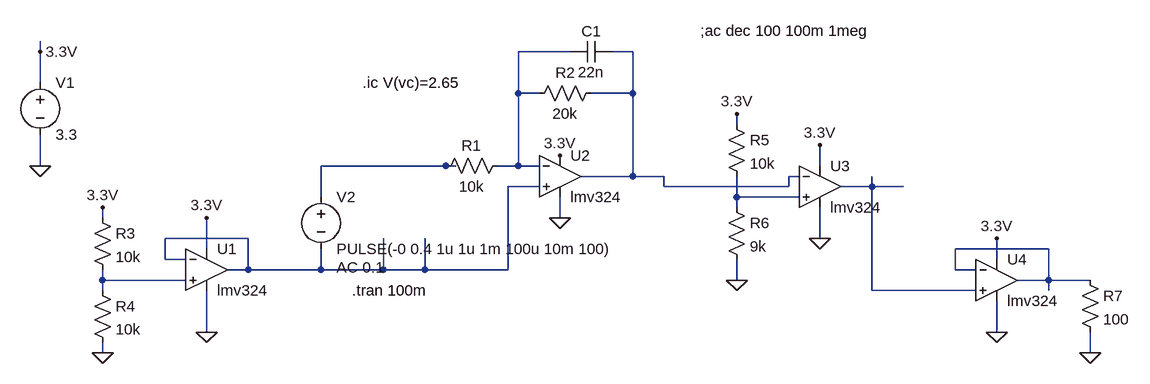
[diagram p0: schematic Piezo_amplifier.asc]
Piezo_amplifier.asc, the LTspice schematic file:
Version 4
SHEET 1 1092 680
WIRE -592 -16 -592 -32
WIRE 224 -16 144 -16
WIRE 320 -16 288 -16
WIRE -592 32 -592 -16
WIRE 144 48 144 -16
WIRE 176 48 144 48
WIRE 320 48 320 -16
WIRE 320 48 256 48
WIRE 480 96 480 80
WIRE -592 160 -592 112
WIRE 32 160 -160 160
WIRE 48 160 32 160
WIRE 144 160 144 48
WIRE 144 160 112 160
WIRE 176 160 144 160
WIRE 608 160 608 128
WIRE 320 176 320 48
WIRE 320 176 240 176
WIRE 368 176 320 176
WIRE 576 176 560 176
WIRE 176 192 128 192
WIRE 368 192 368 176
WIRE 560 192 560 176
WIRE 560 192 368 192
WIRE 688 192 688 176
WIRE 688 192 640 192
WIRE 736 192 688 192
WIRE -160 208 -160 160
WIRE 480 208 480 176
WIRE 576 208 480 208
WIRE 480 224 480 208
WIRE -496 240 -496 224
WIRE 208 240 208 208
WIRE -272 272 -400 272
WIRE 608 272 608 224
WIRE -336 288 -336 240
WIRE 960 288 816 288
WIRE -400 304 -400 272
WIRE -368 304 -400 304
WIRE 880 304 880 272
WIRE -272 320 -272 272
WIRE -272 320 -304 320
WIRE -160 320 -160 288
WIRE -160 320 -272 320
WIRE -64 320 -64 272
WIRE -64 320 -160 320
WIRE 0 320 0 272
WIRE 0 320 -64 320
WIRE 128 320 128 192
WIRE 128 320 0 320
WIRE 816 320 816 288
WIRE 848 320 816 320
WIRE -496 336 -496 320
WIRE -368 336 -496 336
WIRE 480 336 480 304
WIRE 960 336 960 288
WIRE 960 336 912 336
WIRE 1024 336 960 336
WIRE -496 352 -496 336
WIRE 688 352 688 192
WIRE 848 352 688 352
WIRE 960 352 960 336
WIRE -336 416 -336 352
WIRE 880 416 880 368
WIRE -496 448 -496 432
WIRE 1024 448 1024 416
FLAG -592 160 0
FLAG -592 -16 3.3V
FLAG 208 144 3.3V
FLAG 208 240 0
FLAG -336 240 3.3V
FLAG -336 416 0
FLAG -496 448 0
FLAG -496 224 3.3V
FLAG 608 128 3.3V
FLAG 608 272 0
FLAG 480 336 0
FLAG 480 80 3.3V
FLAG 880 272 3.3V
FLAG 880 416 0
FLAG 1024 448 0
SYMBOL voltage -592 16 R0
WINDOW 123 0 0 Left 0
WINDOW 39 0 0 Left 0
SYMATTR InstName V1
SYMATTR Value 3.3
SYMBOL res -512 224 R0
SYMATTR InstName R3
SYMATTR Value 10k
SYMBOL res -512 336 R0
SYMATTR InstName R4
SYMATTR Value 10k
SYMBOL res 464 80 R0
SYMATTR InstName R5
SYMATTR Value 10k
SYMBOL res 464 208 R0
SYMATTR InstName R6
SYMATTR Value 9k
SYMBOL res 128 144 R90
WINDOW 0 0 56 VBottom 2
WINDOW 3 32 56 VTop 2
SYMATTR InstName R1
SYMATTR Value 10k
SYMBOL res 272 32 R90
WINDOW 0 0 56 VBottom 2
WINDOW 3 32 56 VTop 2
SYMATTR InstName R2
SYMATTR Value 20k
SYMBOL voltage -160 192 R0
WINDOW 123 24 124 Left 2
WINDOW 39 0 0 Left 0
SYMATTR Value2 AC 0.1
SYMATTR InstName V2
SYMATTR Value PULSE(-0 0.4 1u 1u 1m 100u 10m 100)
SYMBOL lmv324 -336 256 R0
SYMATTR InstName U1
SYMBOL lmv324 208 112 R0
SYMATTR InstName U2
SYMBOL lmv324 608 128 R0
SYMATTR InstName U3
SYMBOL cap 288 -32 R90
WINDOW 0 0 32 VBottom 2
WINDOW 3 32 32 VTop 2
SYMATTR InstName C1
SYMATTR Value 22n
SYMBOL lmv324 880 272 R0
SYMATTR InstName U4
SYMBOL res 1008 320 R0
SYMATTR InstName R7
SYMATTR Value 100
TEXT -112 352 Left 2 !.tran 100m
TEXT -96 32 Left 2 !.ic V(vc)=2.65
TEXT 424 -48 Left 2 !;ac dec 100 100m 1meg

The netlist it stands for:
* Piezo_amplifier.asc
V1 3.3V 0 3.3
R3 3.3V N008 10k
R4 N008 0 10k
R5 3.3V N006 10k
R6 N006 0 9k
R1 N001 N003 10k
R2 N002 N001 20k
V2 N003 N004 PULSE(-0 0.4 1u 1u 1m 100u 10m 100) AC 0.1
* U1: lmv324 (symbol lmv324 not available, pins judged from their places): In+=N008 In-=N004 V+=3.3V V-=0 OUT=N004
* U2: lmv324 (symbol lmv324 not available, pins judged from their places): In+=N004 In-=N001 V+=3.3V V-=0 OUT=N002
* U3: lmv324 (symbol lmv324 not available, pins judged from their places): In+=N006 In-=N002 V+=3.3V V-=0 OUT=N005
C1 N002 N001 22n
* U4: lmv324 (symbol lmv324 not available, pins judged from their places): In+=N005 In-=N007 V+=3.3V V-=0 OUT=N007
R7 N007 0 100
.tran 100m
.ic V(vc)=2.65
;ac dec 100 100m 1meg
.backanno
.end